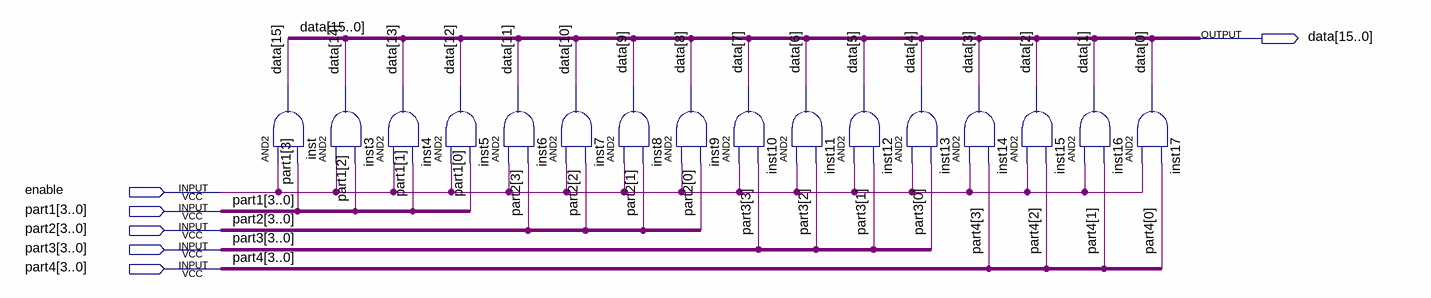
[diagram p0: schematic sheet]
// Quartus schematic SUM.bdf as structural Verilog: 16 symbols, 6 pins
module SUM (
  input  enable,
  input  [3:0] part1,
  input  [3:0] part2,
  input  [3:0] part3,
  input  [3:0] part4,
  output [15:0] data
);

  and inst (data[15], enable, part1[3]);
  and inst3 (data[14], enable, part1[2]);
  and inst4 (data[13], enable, part1[1]);
  and inst5 (data[12], enable, part1[0]);
  and inst6 (data[11], enable, part2[3]);
  and inst7 (data[10], enable, part2[2]);
  and inst8 (data[9], enable, part2[1]);
  and inst9 (data[8], enable, part2[0]);
  and inst10 (data[7], enable, part3[3]);
  and inst11 (data[6], enable, part3[2]);
  and inst12 (data[5], enable, part3[1]);
  and inst13 (data[4], enable, part3[0]);
  and inst14 (data[3], enable, part4[3]);
  and inst15 (data[2], enable, part4[2]);
  and inst16 (data[1], enable, part4[1]);
  and inst17 (data[0], enable, part4[0]);
endmodule
